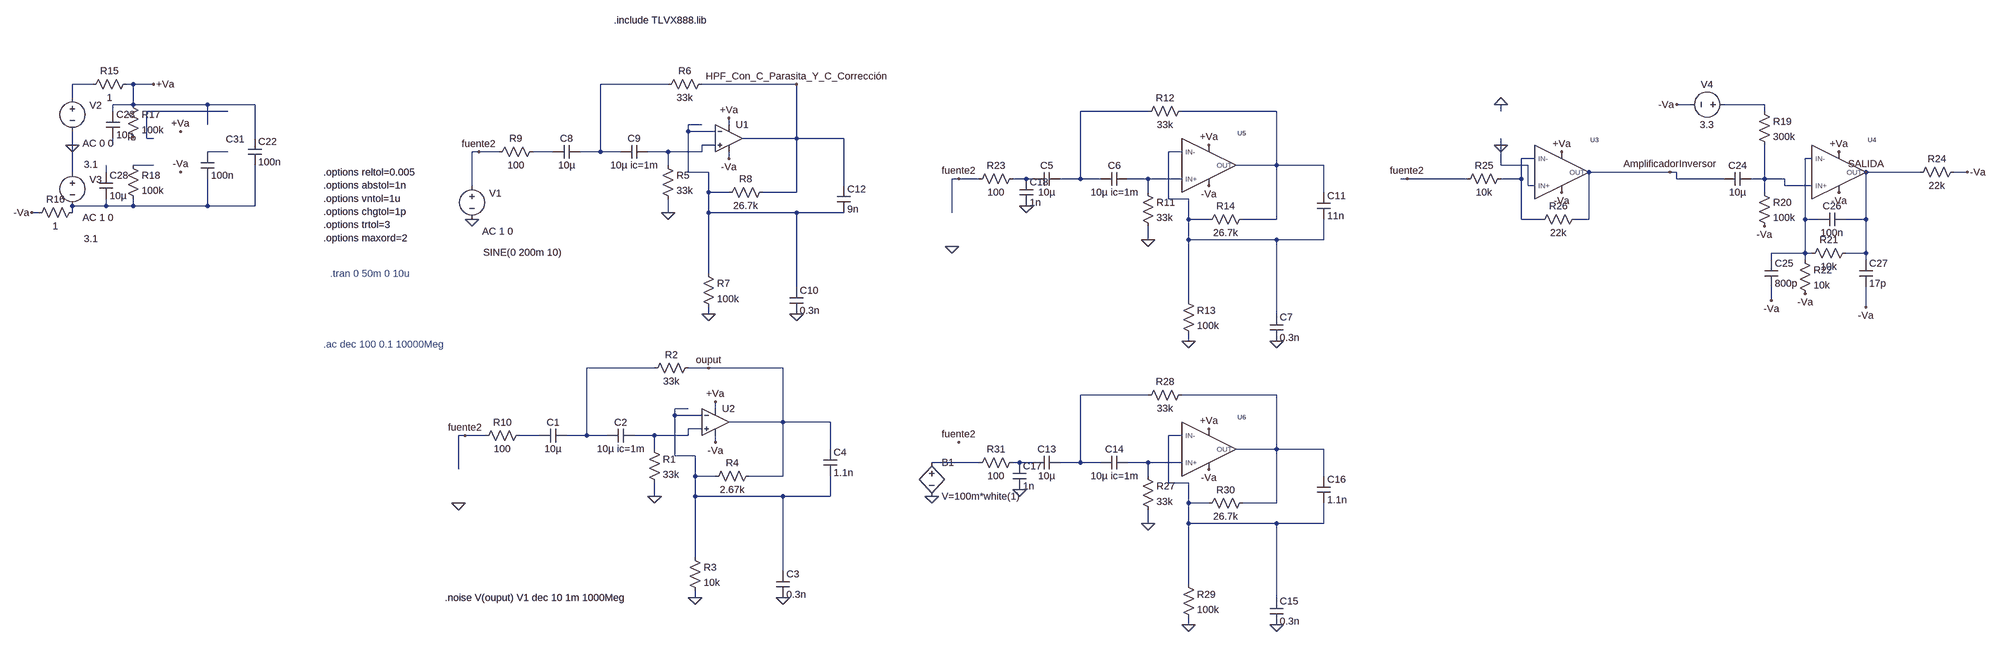
[diagram p0: schematic FILTRADO_copia.asc]
FILTRADO_copia.asc, the LTspice schematic file:
Version 4.1
SHEET 1 3256 1236
WIRE -1760 -64 -1808 -64
WIRE -1664 -64 -1680 -64
WIRE -1616 -64 -1664 -64
WIRE -320 -64 -480 -64
WIRE -16 -64 -240 -64
WIRE -1808 -32 -1808 -64
WIRE -1664 -16 -1664 -64
WIRE -1664 -16 -1712 -16
WIRE -1488 -16 -1664 -16
WIRE -1376 -16 -1488 -16
WIRE 2544 -16 2512 -16
WIRE 2720 -16 2624 -16
WIRE -1712 0 -1712 -16
WIRE -1440 0 -1632 0
WIRE 816 0 656 0
WIRE 1120 0 896 0
WIRE 2096 0 2096 -16
WIRE 2720 0 2720 -16
WIRE -1488 32 -1488 -16
WIRE -240 32 -272 32
WIRE -176 32 -176 16
WIRE -272 48 -272 32
WIRE -208 48 -272 48
WIRE -1632 64 -1632 0
WIRE -1616 64 -1632 64
WIRE -1376 64 -1376 -16
WIRE -16 64 -16 -64
WIRE -16 64 -144 64
WIRE 96 64 -16 64
WIRE -1808 80 -1808 48
WIRE -1712 80 -1712 64
WIRE -208 80 -240 80
WIRE 2096 80 2096 64
WIRE -1440 96 -1488 96
WIRE -768 96 -784 96
WIRE -720 96 -768 96
WIRE -592 96 -640 96
WIRE -480 96 -480 -64
WIRE -480 96 -528 96
WIRE -432 96 -480 96
WIRE -320 96 -368 96
WIRE -240 96 -240 80
WIRE -240 96 -320 96
WIRE 896 96 864 96
WIRE -176 112 -176 96
WIRE 2176 112 2144 112
WIRE 2832 112 2816 112
WIRE -1616 128 -1664 128
WIRE -320 128 -320 96
WIRE 1120 128 1120 0
WIRE 1120 128 1024 128
WIRE 1232 128 1120 128
WIRE 2096 128 2096 80
WIRE 2160 128 2096 128
WIRE -1808 144 -1808 80
WIRE -1728 144 -1728 128
WIRE -272 144 -272 48
WIRE -224 144 -272 144
WIRE 2496 144 2304 144
WIRE 2512 144 2496 144
WIRE 3088 144 2960 144
WIRE 3200 144 3168 144
WIRE 368 160 352 160
WIRE 416 160 368 160
WIRE 528 160 496 160
WIRE 544 160 528 160
WIRE 656 160 656 0
WIRE 656 160 608 160
WIRE 704 160 656 160
WIRE 816 160 768 160
WIRE 896 160 816 160
WIRE 1856 160 1840 160
WIRE 2016 160 1856 160
WIRE 2144 160 2144 112
WIRE 2144 160 2096 160
WIRE 2512 160 2512 144
WIRE 2624 160 2512 160
WIRE 2720 160 2720 80
WIRE 2720 160 2688 160
WIRE 2768 160 2720 160
WIRE -784 176 -784 96
WIRE 96 176 96 64
WIRE 2160 176 2160 128
WIRE 2176 176 2160 176
WIRE 2768 176 2768 160
WIRE 2832 176 2768 176
WIRE -224 192 -224 144
WIRE -176 192 -224 192
WIRE -16 192 -16 64
WIRE -16 192 -96 192
WIRE 816 192 816 160
WIRE 1232 192 1232 128
WIRE 2720 192 2720 160
WIRE 864 208 864 96
WIRE 912 208 864 208
WIRE -1728 224 -1728 208
WIRE -1728 224 -1808 224
WIRE -1664 224 -1664 208
WIRE -1664 224 -1728 224
WIRE -1488 224 -1488 160
WIRE -1488 224 -1664 224
WIRE -1376 224 -1376 128
WIRE -1376 224 -1488 224
WIRE -1888 240 -1904 240
WIRE -1808 240 -1808 224
WIRE -320 240 -320 208
WIRE -224 240 -224 192
WIRE -16 240 -224 240
WIRE 96 240 -16 240
WIRE 352 240 352 160
WIRE 912 256 912 208
WIRE 960 256 912 256
WIRE 1120 256 1120 128
WIRE 1120 256 1040 256
WIRE 2144 256 2144 160
WIRE 2192 256 2144 256
WIRE 2304 256 2304 144
WIRE 2304 256 2272 256
WIRE 2816 256 2816 112
WIRE 2848 256 2816 256
WIRE 2960 256 2960 144
WIRE 2960 256 2912 256
WIRE 816 304 816 272
WIRE 912 304 912 256
WIRE 1120 304 912 304
WIRE 1232 304 1232 256
WIRE 1232 304 1120 304
WIRE 2816 336 2816 256
WIRE 2816 336 2736 336
WIRE 2832 336 2816 336
WIRE 2960 336 2960 256
WIRE 2960 336 2912 336
WIRE 2736 352 2736 336
WIRE 2816 352 2816 336
WIRE 2960 352 2960 336
WIRE -224 384 -224 240
WIRE -16 416 -16 240
WIRE 912 448 912 304
WIRE 2736 448 2736 416
WIRE 2960 464 2960 416
WIRE -224 480 -224 464
WIRE 1120 480 1120 304
WIRE 912 544 912 528
WIRE -352 608 -512 608
WIRE -224 608 -272 608
WIRE -48 608 -224 608
WIRE 816 672 656 672
WIRE 1120 672 896 672
WIRE -272 704 -304 704
WIRE -208 704 -208 688
WIRE -304 720 -304 704
WIRE -240 720 -304 720
WIRE -48 736 -48 608
WIRE -48 736 -176 736
WIRE 64 736 -48 736
WIRE -240 752 -272 752
WIRE -800 768 -816 768
WIRE -752 768 -800 768
WIRE -624 768 -672 768
WIRE -512 768 -512 608
WIRE -512 768 -560 768
WIRE -464 768 -512 768
WIRE -352 768 -400 768
WIRE -272 768 -272 752
WIRE -272 768 -352 768
WIRE 896 768 864 768
WIRE -208 784 -208 768
WIRE -352 800 -352 768
WIRE 64 800 64 736
WIRE 1120 800 1120 672
WIRE 1120 800 1024 800
WIRE 1232 800 1120 800
WIRE -304 816 -304 720
WIRE -256 816 -304 816
WIRE 416 832 304 832
WIRE 512 832 496 832
WIRE 544 832 512 832
WIRE 656 832 656 672
WIRE 656 832 608 832
WIRE 704 832 656 832
WIRE 816 832 768 832
WIRE 896 832 816 832
WIRE -816 848 -816 768
WIRE -256 864 -256 816
WIRE -208 864 -256 864
WIRE -48 864 -48 736
WIRE -48 864 -128 864
WIRE 816 864 816 832
WIRE 1232 864 1232 800
WIRE 864 880 864 768
WIRE 912 880 864 880
WIRE -352 912 -352 880
WIRE -256 912 -256 864
WIRE -48 912 -256 912
WIRE 64 912 64 864
WIRE 64 912 -48 912
WIRE 912 928 912 880
WIRE 960 928 912 928
WIRE 1120 928 1120 800
WIRE 1120 928 1040 928
WIRE 816 976 816 944
WIRE 912 976 912 928
WIRE 1120 976 912 976
WIRE 1232 976 1232 928
WIRE 1232 976 1120 976
WIRE -256 1056 -256 912
WIRE -48 1088 -48 912
WIRE 912 1120 912 976
WIRE -256 1152 -256 1136
WIRE 1120 1152 1120 976
WIRE 912 1216 912 1200
FLAG -320 240 0
FLAG -176 16 +Va
FLAG -176 112 -Va
FLAG -16 -64 HPF_Con_C_Parasita_Y_C_Corrección
FLAG -224 480 0
FLAG -784 256 0
FLAG -768 96 fuente2
FLAG -16 480 0
FLAG -1808 80 0
FLAG -1904 240 -Va
FLAG -1616 -64 +Va
FLAG 2896 192 -Va
FLAG 2896 96 +Va
FLAG -1552 48 +Va
FLAG -1552 144 -Va
FLAG 2720 272 -Va
FLAG 2512 -16 -Va
FLAG 2736 448 -Va
FLAG 2816 432 -Va
FLAG 2960 144 SALIDA
FLAG 3200 144 -Va
FLAG 2960 464 -Va
FLAG 2240 96 +Va
FLAG 2240 192 -Va
FLAG 2096 -16 0
FLAG 2496 144 AmplificadorInversor
FLAG 2096 80 0
FLAG -352 912 0
FLAG -208 688 +Va
FLAG -208 784 -Va
FLAG -256 1152 0
FLAG -816 928 0
FLAG -800 768 fuente2
FLAG -48 1152 0
FLAG 816 304 0
FLAG 960 80 +Va
FLAG 960 176 -Va
FLAG 912 544 0
FLAG 352 320 0
FLAG 368 160 fuente2
FLAG 1120 544 0
FLAG 816 976 0
FLAG 960 752 +Va
FLAG 960 848 -Va
FLAG 912 1216 0
FLAG 304 912 0
FLAG 368 784 fuente2
FLAG 1120 1216 0
FLAG 1856 160 fuente2
FLAG 512 896 0
FLAG 528 224 0
FLAG -224 608 ouput
SYMBOL cap -528 80 R90
WINDOW 0 0 32 VBottom 2
WINDOW 3 32 32 VTop 2
SYMATTR InstName C8
SYMATTR Value 10µ
SYMBOL cap -368 80 R90
WINDOW 0 0 32 VBottom 2
WINDOW 3 32 32 VTop 2
SYMATTR InstName C9
SYMATTR Value 10µ ic=1m
SYMBOL res -336 112 R0
SYMATTR InstName R5
SYMATTR Value 33k
SYMBOL res -224 -80 R90
WINDOW 0 0 56 VBottom 2
WINDOW 3 32 56 VTop 2
SYMATTR InstName R6
SYMATTR Value 33k
SYMBOL res -240 368 R0
SYMATTR InstName R7
SYMATTR Value 100k
SYMBOL res -80 176 R90
WINDOW 0 0 56 VBottom 2
WINDOW 3 32 56 VTop 2
SYMATTR InstName R8
SYMATTR Value 26.7k
SYMBOL voltage -784 160 R0
WINDOW 0 41 34 Left 2
WINDOW 123 24 124 Left 2
WINDOW 39 0 0 Left 0
WINDOW 3 27 174 Left 2
SYMATTR InstName V1
SYMATTR Value2 AC 1 0
SYMATTR Value SINE(0 200m 10)
SYMBOL res -624 80 R90
WINDOW 0 0 56 VBottom 2
WINDOW 3 32 56 VTop 2
SYMATTR InstName R9
SYMATTR Value 100
SYMBOL cap -32 416 R0
SYMATTR InstName C10
SYMATTR Value 0.3n
SYMBOL cap 80 176 R0
SYMATTR InstName C12
SYMATTR Value 9n
SYMBOL voltage -1808 -48 R0
WINDOW 0 41 34 Left 2
WINDOW 123 24 124 Left 2
WINDOW 39 0 0 Left 0
WINDOW 3 27 174 Left 2
SYMATTR InstName V2
SYMATTR Value2 AC 0 0
SYMATTR Value 3.1
SYMBOL voltage -1808 128 R0
WINDOW 0 41 34 Left 2
WINDOW 123 24 124 Left 2
WINDOW 39 0 0 Left 0
WINDOW 3 27 174 Left 2
SYMATTR InstName V3
SYMATTR Value2 AC 1 0
SYMATTR Value 3.1
SYMBOL res -1664 -80 R90
WINDOW 0 0 56 VBottom 2
WINDOW 3 32 56 VTop 2
SYMATTR InstName R15
SYMATTR Value 1
SYMBOL res -1792 224 R90
WINDOW 0 0 56 VBottom 2
WINDOW 3 32 56 VTop 2
SYMATTR InstName R16
SYMATTR Value 1
SYMBOL res -1680 -32 R0
SYMATTR InstName R17
SYMATTR Value 100k
SYMBOL res -1680 112 R0
SYMATTR InstName R18
SYMATTR Value 100k
SYMBOL voltage 2640 -16 R90
WINDOW 0 -32 56 VBottom 2
WINDOW 3 32 56 VTop 2
WINDOW 123 0 0 Left 0
WINDOW 39 0 0 Left 0
SYMATTR InstName V4
SYMATTR Value 3.3
SYMBOL res 2704 -16 R0
SYMATTR InstName R19
SYMATTR Value 300k
SYMBOL res 2704 176 R0
SYMATTR InstName R20
SYMATTR Value 100k
SYMBOL cap 2688 144 R90
WINDOW 0 0 32 VBottom 2
WINDOW 3 32 32 VTop 2
SYMATTR InstName C24
SYMATTR Value 10µ
SYMBOL res 2928 320 R90
WINDOW 0 0 56 VBottom 2
WINDOW 3 32 56 VTop 2
SYMATTR InstName R21
SYMATTR Value 10k
SYMBOL res 2800 336 R0
SYMATTR InstName R22
SYMATTR Value 10k
SYMBOL cap 2720 352 R0
SYMATTR InstName C25
SYMATTR Value 800p
SYMBOL cap 2912 240 R90
WINDOW 0 0 32 VBottom 2
WINDOW 3 32 32 VTop 2
SYMATTR InstName C26
SYMATTR Value 100n
SYMBOL cap 2944 352 R0
SYMATTR InstName C27
SYMATTR Value 17p
SYMBOL res 3184 128 R90
WINDOW 0 0 56 VBottom 2
WINDOW 3 32 56 VTop 2
SYMATTR InstName R24
SYMATTR Value 22k
SYMBOL cap -1392 64 R0
SYMATTR InstName C22
SYMATTR Value 100n
SYMBOL cap -1728 0 R0
SYMATTR InstName C23
SYMATTR Value 10µ
SYMBOL cap -1744 144 R0
SYMATTR InstName C28
SYMATTR Value 10µ
SYMBOL res 2288 240 R90
WINDOW 0 0 56 VBottom 2
WINDOW 3 32 56 VTop 2
SYMATTR InstName R26
SYMATTR Value 22k
SYMBOL res 2112 144 R90
WINDOW 0 0 56 VBottom 2
WINDOW 3 32 56 VTop 2
SYMATTR InstName R25
SYMATTR Value 10k
SYMBOL TLVx888 2240 144 R0
SYMATTR InstName U3
SYMBOL TLVx888 2896 144 R0
SYMATTR InstName U4
SYMBOL cap -1504 96 R0
WINDOW 0 59 -30 Left 2
SYMATTR InstName C31
SYMATTR Value 100n
SYMBOL lib\\sym\\ZZZ\\OpAmps\\UniversalOpamp2 -176 64 R0
SYMATTR InstName U1
SYMATTR Value2 Avol=10Meg GBW=13Meg Slew=40Meg
SYMATTR SpiceLine Ilimit=40m Rail=0 Vos=0
SYMBOL cap -560 752 R90
WINDOW 0 0 32 VBottom 2
WINDOW 3 32 32 VTop 2
SYMATTR InstName C1
SYMATTR Value 10µ
SYMBOL cap -400 752 R90
WINDOW 0 0 32 VBottom 2
WINDOW 3 32 32 VTop 2
SYMATTR InstName C2
SYMATTR Value 10µ ic=1m
SYMBOL res -368 784 R0
SYMATTR InstName R1
SYMATTR Value 33k
SYMBOL res -256 592 R90
WINDOW 0 0 56 VBottom 2
WINDOW 3 32 56 VTop 2
SYMATTR InstName R2
SYMATTR Value 33k
SYMBOL res -272 1040 R0
SYMATTR InstName R3
SYMATTR Value 10k
SYMBOL res -112 848 R90
WINDOW 0 0 56 VBottom 2
WINDOW 3 32 56 VTop 2
SYMATTR InstName R4
SYMATTR Value 2.67k
SYMBOL res -656 752 R90
WINDOW 0 0 56 VBottom 2
WINDOW 3 32 56 VTop 2
SYMATTR InstName R10
SYMATTR Value 100
SYMBOL cap -64 1088 R0
SYMATTR InstName C3
SYMATTR Value 0.3n
SYMBOL cap 48 800 R0
SYMATTR InstName C4
SYMATTR Value 1.1n
SYMBOL lib\\sym\\ZZZ\\OpAmps\\UniversalOpamp2 -208 736 R0
SYMATTR InstName U2
SYMATTR Value2 Avol=10Meg GBW=13Meg Slew=40Meg
SYMATTR SpiceLine Ilimit=40m Rail=0 Vos=0
SYMBOL cap 608 144 R90
WINDOW 0 0 32 VBottom 2
WINDOW 3 32 32 VTop 2
SYMATTR InstName C5
SYMATTR Value 10µ
SYMBOL cap 768 144 R90
WINDOW 0 0 32 VBottom 2
WINDOW 3 32 32 VTop 2
SYMATTR InstName C6
SYMATTR Value 10µ ic=1m
SYMBOL res 800 176 R0
SYMATTR InstName R11
SYMATTR Value 33k
SYMBOL res 912 -16 R90
WINDOW 0 0 56 VBottom 2
WINDOW 3 32 56 VTop 2
SYMATTR InstName R12
SYMATTR Value 33k
SYMBOL res 896 432 R0
SYMATTR InstName R13
SYMATTR Value 100k
SYMBOL res 1056 240 R90
WINDOW 0 0 56 VBottom 2
WINDOW 3 32 56 VTop 2
SYMATTR InstName R14
SYMATTR Value 26.7k
SYMBOL res 512 144 R90
WINDOW 0 0 56 VBottom 2
WINDOW 3 32 56 VTop 2
SYMATTR InstName R23
SYMATTR Value 100
SYMBOL cap 1104 480 R0
SYMATTR InstName C7
SYMATTR Value 0.3n
SYMBOL cap 1216 192 R0
SYMATTR InstName C11
SYMATTR Value 11n
SYMBOL TLVx888 960 128 R0
SYMATTR InstName U5
SYMBOL cap 608 816 R90
WINDOW 0 0 32 VBottom 2
WINDOW 3 32 32 VTop 2
SYMATTR InstName C13
SYMATTR Value 10µ
SYMBOL cap 768 816 R90
WINDOW 0 0 32 VBottom 2
WINDOW 3 32 32 VTop 2
SYMATTR InstName C14
SYMATTR Value 10µ ic=1m
SYMBOL res 800 848 R0
SYMATTR InstName R27
SYMATTR Value 33k
SYMBOL res 912 656 R90
WINDOW 0 0 56 VBottom 2
WINDOW 3 32 56 VTop 2
SYMATTR InstName R28
SYMATTR Value 33k
SYMBOL res 896 1104 R0
SYMATTR InstName R29
SYMATTR Value 100k
SYMBOL res 1056 912 R90
WINDOW 0 0 56 VBottom 2
WINDOW 3 32 56 VTop 2
SYMATTR InstName R30
SYMATTR Value 26.7k
SYMBOL res 512 816 R90
WINDOW 0 0 56 VBottom 2
WINDOW 3 32 56 VTop 2
SYMATTR InstName R31
SYMATTR Value 100
SYMBOL cap 1104 1152 R0
SYMATTR InstName C15
SYMATTR Value 0.3n
SYMBOL cap 1216 864 R0
SYMATTR InstName C16
SYMATTR Value 1.1n
SYMBOL TLVx888 960 800 R0
SYMATTR InstName U6
SYMBOL cap 496 832 R0
SYMATTR InstName C17
SYMATTR Value 1n
SYMBOL cap 512 160 R0
SYMATTR InstName C18
SYMATTR Value 1n
SYMBOL bv 304 816 R0
SYMATTR InstName B1
SYMATTR Value V=100m*white(1)
TEXT -1120 384 Left 2 ;.tran 0 50m 0 10u
TEXT -1136 144 Left 2 !.options reltol=0.005\n.options abstol=1n\n.options vntol=1u\n.options chgtol=1p\n.options trtol=3\n.options maxord=2
TEXT -1136 552 Left 2 ;.ac dec 100 0.1 10000Meg
TEXT -448 -256 Left 2 !.include TLVX888.lib
TEXT -848 1152 Left 2 !.noise V(ouput) V1 dec 10 1m 1000Meg

The netlist it stands for:
* FILTRADO_copia.asc
C8 N002 N011 10µ
C9 N009 N002 10µ ic=1m
R5 N009 0 33k
R6 HPF_Con_C_Parasita_Y_C_Corrección N002 33k
R7 N007 0 100k
R8 HPF_Con_C_Parasita_Y_C_Corrección N007 26.7k
V1 fuente2 0 SINE(0 200m 10) AC 1 0
R9 N011 fuente2 100
C10 N007 0 0.3n
C12 HPF_Con_C_Parasita_Y_C_Corrección N007 9n
V2 N001 0 3.1 AC 0 0
V3 0 N020 3.1 AC 1 0
R15 +Va N001 1
R16 N020 -Va 1
R17 +Va NC_01 100k
R18 N015 N020 100k
V4 N003 -Va 3.3
R19 N003 N019 300k
R20 N019 -Va 100k
C24 N019 AmplificadorInversor 10µ
R21 SALIDA N014 10k
R22 N014 -Va 10k
C25 N014 -Va 800p
C26 SALIDA N014 100n
C27 SALIDA -Va 17p
R24 -Va SALIDA 22k
C22 +Va N020 100n
C23 +Va N008 10µ
C28 N016 N020 10µ
R26 AmplificadorInversor N013 22k
R25 N013 fuente2 10k
X§U3 0 N013 +Va -Va AmplificadorInversor TLVX888  ; pins IN+ IN- VCC VEE OUT
X§U4 N019 N014 +Va -Va SALIDA TLVX888  ; pins IN+ IN- VCC VEE OUT
C31 N010 N020 100n
X§U1 N009 N007 +Va -Va HPF_Con_C_Parasita_Y_C_Corrección level.2 Avol=10Meg GBW=13Meg Slew=40Meg Ilimit=40m Rail=0 Vos=0 en=0 enk=0 in=0 ink=0 Rin=500Meg  ; pins IN+ IN- V+ V- OUT
C1 N021 N026 10µ
C2 N025 N021 10µ ic=1m
R1 N025 0 33k
R2 ouput N021 33k
R3 N024 0 10k
R4 ouput N024 2.67k
R10 N026 fuente2 100
C3 N024 0 0.3n
C4 ouput N024 1.1n
X§U2 N025 N024 +Va -Va ouput level.2 Avol=10Meg GBW=13Meg Slew=40Meg Ilimit=40m Rail=0 Vos=0 en=0 enk=0 in=0 ink=0 Rin=500Meg  ; pins IN+ IN- V+ V- OUT
C5 N005 N017 10µ
C6 N018 N005 10µ ic=1m
R11 N018 0 33k
R12 N006 N005 33k
R13 N012 0 100k
R14 N006 N012 26.7k
R23 N017 fuente2 100
C7 N012 0 0.3n
C11 N006 N012 11n
X§U5 N018 N012 +Va -Va N006 TLVX888  ; pins IN+ IN- VCC VEE OUT
C13 N022 N029 10µ
C14 N030 N022 10µ ic=1m
R27 N030 0 33k
R28 N023 N022 33k
R29 N027 0 100k
R30 N023 N027 26.7k
R31 N029 N028 100
C15 N027 0 0.3n
C16 N023 N027 1.1n
X§U6 N030 N027 +Va -Va N023 TLVX888  ; pins IN+ IN- VCC VEE OUT
C17 N029 0 1n
C18 N017 0 1n
B1 N028 0 V=100m*white(1)
* .tran 0 50m 0 10u
.options reltol=0.005
.options abstol=1n
.options vntol=1u
.options chgtol=1p
.options trtol=3
.options maxord=2
* .ac dec 100 0.1 10000Meg
.include TLVX888.lib
.noise V(ouput) V1 dec 10 1m 1000Meg
.lib UniversalOpamps2.sub
.backanno
.end